# Altium schematic sheet FMC_Clocks.SchDoc
size A4; DocumentNumber: 27; SheetNumber: 27; SheetTotal: 30
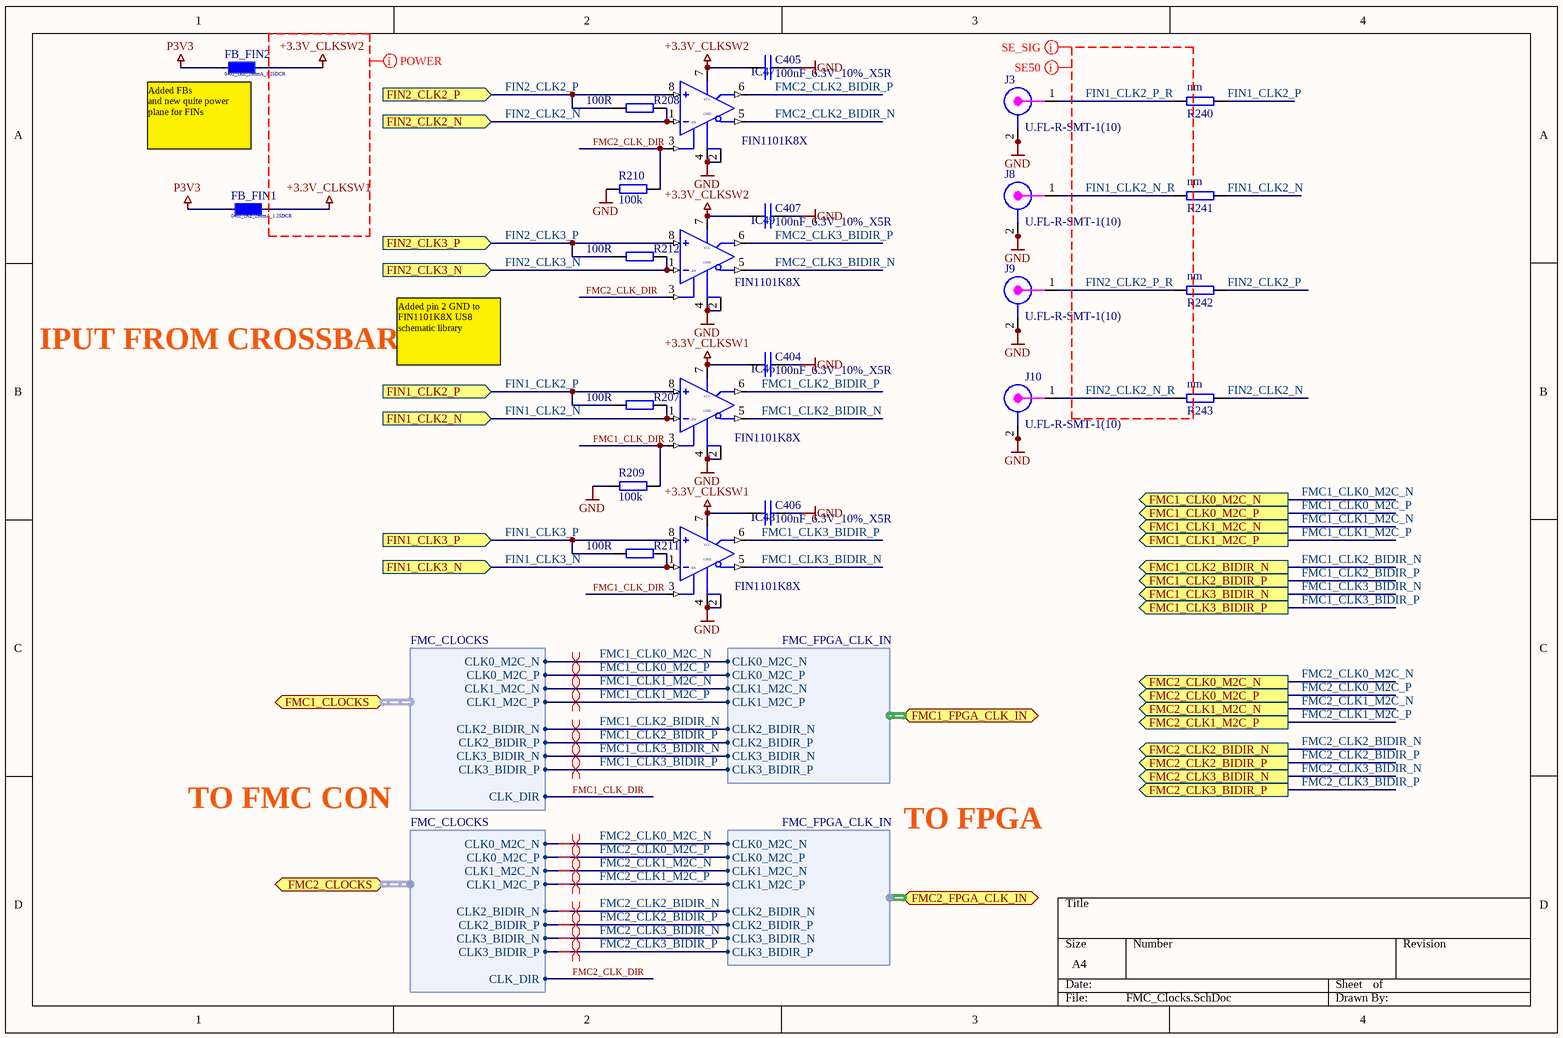
[diagram p0: FMC_Clocks.SchDoc]

## Parts
C404  100nF_6.3V_10%_X5R  [0201C]
C405  100nF_6.3V_10%_X5R  [0201C]
C406  100nF_6.3V_10%_X5R  [0201C]
C407  100nF_6.3V_10%_X5R  [0201C]
FB_FIN1  0402_1KZ_250mA_1.25DCR  [INDC1005X55N]
FB_FIN2  0402_1KZ_250mA_1.25DCR  [INDC1005X55N]
IC46  FIN1101K8X  [US8]
IC47  FIN1101K8X  [US8]
IC48  FIN1101K8X  [US8]
IC49  FIN1101K8X  [US8]
J3  U.FL-R-SMT-1(10)  [CON_UFL_HIROSE_RECEPTACLE]
J8  U.FL-R-SMT-1(10)  [CON_UFL_HIROSE_RECEPTACLE]
J9  U.FL-R-SMT-1(10)  [CON_UFL_HIROSE_RECEPTACLE]
J10  U.FL-R-SMT-1(10)  [CON_UFL_HIROSE_RECEPTACLE]
R207  100R  [0402R]
R208  100R  [0402R]
R209  100k  [0402R]
R210  100k  [0402R]
R211  100R  [0402R]
R212  100R  [0402R]
R240  nm  [0402R]
R241  nm  [0402R]
R242  nm  [0402R]
R243  nm  [0402R]

## Ports
FIN1_CLK2_N (in), FIN1_CLK2_P (in), FIN1_CLK3_N (in), FIN1_CLK3_P (in), FIN2_CLK2_N (in), FIN2_CLK2_P (in), FIN2_CLK3_N (in), FIN2_CLK3_P (in), FMC1_CLK0_M2C_N (out), FMC1_CLK0_M2C_P (out), FMC1_CLK1_M2C_N (out), FMC1_CLK1_M2C_P (out), FMC1_CLK2_BIDIR_N (out), FMC1_CLK2_BIDIR_P (out), FMC1_CLK3_BIDIR_N (out), FMC1_CLK3_BIDIR_P (out), FMC1_CLOCKS (harness FMC_CLOCKS), FMC1_FPGA_CLK_IN (harness FMC_FPGA_CLK_IN), FMC2_CLK0_M2C_N (out), FMC2_CLK0_M2C_P (out), FMC2_CLK1_M2C_N (out), FMC2_CLK1_M2C_P (out), FMC2_CLK2_BIDIR_N (out), FMC2_CLK2_BIDIR_P (out), FMC2_CLK3_BIDIR_N (out), FMC2_CLK3_BIDIR_P (out), FMC2_CLOCKS (harness FMC_CLOCKS), FMC2_FPGA_CLK_IN (harness FMC_FPGA_CLK_IN)

## Harnesses
FMC_CLOCKS: CLK0_M2C_N, CLK0_M2C_P, CLK1_M2C_N, CLK1_M2C_P, CLK_DIR, CLK2_BIDIR_N, CLK2_BIDIR_P, CLK3_BIDIR_N, CLK3_BIDIR_P
FMC_FPGA_CLK_IN: CLK0_M2C_N, CLK0_M2C_P, CLK1_M2C_N, CLK1_M2C_P, CLK2_BIDIR_N, CLK2_BIDIR_P, CLK3_BIDIR_N, CLK3_BIDIR_P

## Nets
+3.3V_CLKSW1: C404.1 C406.1 FB_FIN1.2(-) IC46.7(VCC) IC48.7(VCC)
+3.3V_CLKSW2: C405.1 C407.1 FB_FIN2.2(-) IC47.7(VCC) IC49.7(VCC)
GND: C404.2 C405.2 C406.2 C407.2 IC46.2(GND) IC46.4(GND) IC47.2(GND) IC47.4(GND) IC48.2(GND) IC48.4(GND) IC49.2(GND) IC49.4(GND) J3.2 J3.2a(GND) J8.2 J8.2a(GND) J9.2 J9.2a(GND) J10.2 J10.2a(GND) R209.1 R210.1
P3V3: FB_FIN1.1(+) FB_FIN2.1(+)
FIN1_CLK2_N: IC46.1(IN) R207.1 R241.1 ; port FIN1_CLK2_N
FIN1_CLK2_N_R: J8.1 R241.2
FIN1_CLK2_P: IC46.8(IN) R207.2 R240.1 ; port FIN1_CLK2_P
FIN1_CLK2_P_R: J3.1 R240.2
FIN1_CLK3_N: IC48.1(IN) R211.1 ; port FIN1_CLK3_N
FIN1_CLK3_P: IC48.8(IN) R211.2 ; port FIN1_CLK3_P
FIN2_CLK2_N: IC47.1(IN) R208.1 R243.1 ; port FIN2_CLK2_N
FIN2_CLK2_N_R: J10.1 R243.2
FIN2_CLK2_P: IC47.8(IN) R208.2 R242.1 ; port FIN2_CLK2_P
FIN2_CLK2_P_R: J9.1 R242.2
FIN2_CLK3_N: IC49.1(IN) R212.1 ; port FIN2_CLK3_N
FIN2_CLK3_P: IC49.8(IN) R212.2 ; port FIN2_CLK3_P
FMC1_CLK0_M2C_N: port FMC1_CLK0_M2C_N, port FMC1_CLOCKS.CLK0_M2C_N, port FMC1_FPGA_CLK_IN.CLK0_M2C_N
FMC1_CLK0_M2C_P: port FMC1_CLK0_M2C_P, port FMC1_CLOCKS.CLK0_M2C_P, port FMC1_FPGA_CLK_IN.CLK0_M2C_P
FMC1_CLK1_M2C_N: port FMC1_CLK1_M2C_N, port FMC1_CLOCKS.CLK1_M2C_N, port FMC1_FPGA_CLK_IN.CLK1_M2C_N
FMC1_CLK1_M2C_P: port FMC1_CLK1_M2C_P, port FMC1_CLOCKS.CLK1_M2C_P, port FMC1_FPGA_CLK_IN.CLK1_M2C_P
FMC1_CLK2_BIDIR_N: IC46.5(~{Q}) ; port FMC1_CLK2_BIDIR_N, port FMC1_CLOCKS.CLK2_BIDIR_N, port FMC1_FPGA_CLK_IN.CLK2_BIDIR_N
FMC1_CLK2_BIDIR_P: IC46.6(Q) ; port FMC1_CLK2_BIDIR_P, port FMC1_CLOCKS.CLK2_BIDIR_P, port FMC1_FPGA_CLK_IN.CLK2_BIDIR_P
FMC1_CLK3_BIDIR_N: IC48.5(~{Q}) ; port FMC1_CLK3_BIDIR_N, port FMC1_CLOCKS.CLK3_BIDIR_N, port FMC1_FPGA_CLK_IN.CLK3_BIDIR_N
FMC1_CLK3_BIDIR_P: IC48.6(Q) ; port FMC1_CLK3_BIDIR_P, port FMC1_CLOCKS.CLK3_BIDIR_P, port FMC1_FPGA_CLK_IN.CLK3_BIDIR_P
FMC1_CLK_DIR: IC46.3(EN) IC48.3(EN) R209.2 ; port FMC1_CLOCKS.CLK_DIR
FMC2_CLK0_M2C_N: port FMC2_CLK0_M2C_N, port FMC2_CLOCKS.CLK0_M2C_N, port FMC2_FPGA_CLK_IN.CLK0_M2C_N
FMC2_CLK0_M2C_P: port FMC2_CLK0_M2C_P, port FMC2_CLOCKS.CLK0_M2C_P, port FMC2_FPGA_CLK_IN.CLK0_M2C_P
FMC2_CLK1_M2C_N: port FMC2_CLK1_M2C_N, port FMC2_CLOCKS.CLK1_M2C_N, port FMC2_FPGA_CLK_IN.CLK1_M2C_N
FMC2_CLK1_M2C_P: port FMC2_CLK1_M2C_P, port FMC2_CLOCKS.CLK1_M2C_P, port FMC2_FPGA_CLK_IN.CLK1_M2C_P
FMC2_CLK2_BIDIR_N: IC47.5(~{Q}) ; port FMC2_CLK2_BIDIR_N, port FMC2_CLOCKS.CLK2_BIDIR_N, port FMC2_FPGA_CLK_IN.CLK2_BIDIR_N
FMC2_CLK2_BIDIR_P: IC47.6(Q) ; port FMC2_CLK2_BIDIR_P, port FMC2_CLOCKS.CLK2_BIDIR_P, port FMC2_FPGA_CLK_IN.CLK2_BIDIR_P
FMC2_CLK3_BIDIR_N: IC49.5(~{Q}) ; port FMC2_CLK3_BIDIR_N, port FMC2_CLOCKS.CLK3_BIDIR_N, port FMC2_FPGA_CLK_IN.CLK3_BIDIR_N
FMC2_CLK3_BIDIR_P: IC49.6(Q) ; port FMC2_CLK3_BIDIR_P, port FMC2_CLOCKS.CLK3_BIDIR_P, port FMC2_FPGA_CLK_IN.CLK3_BIDIR_P
FMC2_CLK_DIR: IC47.3(EN) IC49.3(EN) R210.2 ; port FMC2_CLOCKS.CLK_DIR

## Layout directives
differential pair: FMC1_CLK0_M2C_N, FMC1_CLK0_M2C_P, FMC1_CLK1_M2C_N, FMC1_CLK1_M2C_P, FMC1_CLK2_BIDIR_N, FMC1_CLK2_BIDIR_P, FMC1_CLK3_BIDIR_N, FMC1_CLK3_BIDIR_P, FMC2_CLK0_M2C_N, FMC2_CLK0_M2C_P, FMC2_CLK1_M2C_N, FMC2_CLK1_M2C_P, FMC2_CLK2_BIDIR_N, FMC2_CLK2_BIDIR_P, FMC2_CLK3_BIDIR_N, FMC2_CLK3_BIDIR_P
net class SE_SIG: FIN1_CLK2_N_R, FIN1_CLK2_P_R, FIN2_CLK2_N_R, FIN2_CLK2_P_R
net class SE50: FIN1_CLK2_N_R, FIN1_CLK2_P_R, FIN2_CLK2_N_R, FIN2_CLK2_P_R
net class POWER: +3.3V_CLKSW1, +3.3V_CLKSW2

## Notes on the sheet
- (near FB_FIN2) Added FBs
  and new quite power plane for FINs
- IPUT FROM CROSSBAR
- Added pin 2 GND to FIN1101K8X US8 schematic library
- TO FMC CON
- TO FPGA

## Library data of the parts
C404-C407 = CAP_SMD_0201: Capacitor SMD
FB_FIN1 FB_FIN2 = BLM15HD102SN1D: FILTER CHIP 1000 OHM 250MA 0402; Manufacturer: Murata Electronics North America; Impedance @ Frequency: 1K Ohm @ 100MHz; DC Resistance (DCR): 1.25 Ohm Max; Filter Type: Differential Mode - Single; Document Name: FMC_Clocks.SchDoc; Part Number: BLM15HD102SN1D; ParamsList: 0402_1KZ_250mA_1.25DCR; Supplier 1: Digi-Key; Supplier Part Number 1: 490-4003-1-ND; Manufacturer Part Number: BLM15HD102SN1D; RoHS: RoHS Compliant; Category: Filters; Stock 1: 324163; Pricing 1: 1=0.42, 10=0.332, 50=0.2186, 100=0.1734, 250=0.1282, 500=0.09952, 1000=0.07842, 5000=0.05881 (USD); Current Rating: 250mA; Package / Case: 0402 (1005 Metric); Mounting Type: Surface Mount; Packaging: Cut Tape (CT); Height (Max): 0.022" (0.55mm); Size / Dimension: 0.039" L x 0.020" W (1.00mm x 0.50mm); ComponentLink1URL: http://search.murata.co.jp/Ceramy/image/img/PDF/ENG/L0110S0101BLM15H.pdf; ComponentLink1Description: http://search.murata.co.jp/Ceramy/image/img/PDF/ENG/L0110S0101BLM15H.pdf; FootprintSizeX (mm): 1.82; FootprintSizeY (mm): 0.92; FootprintRectangleArea (mm): 1.67; Thickness (Max) (mm): 0.55; FootprintAlias: 0402
IC46-IC49 = IFC_FIN1101K8X: LVDS TO LVDS repeater3.3V
J3 J8-J10 = CON_UFL_SMD: UFL; Supplier 1: Newark; Supplier Part Number 1: 50P8856
R207-R212 R240-R243 = RES_0402: SMD Resistor; Supplier 1: Newark; Supplier Part Number 1: 59M6691